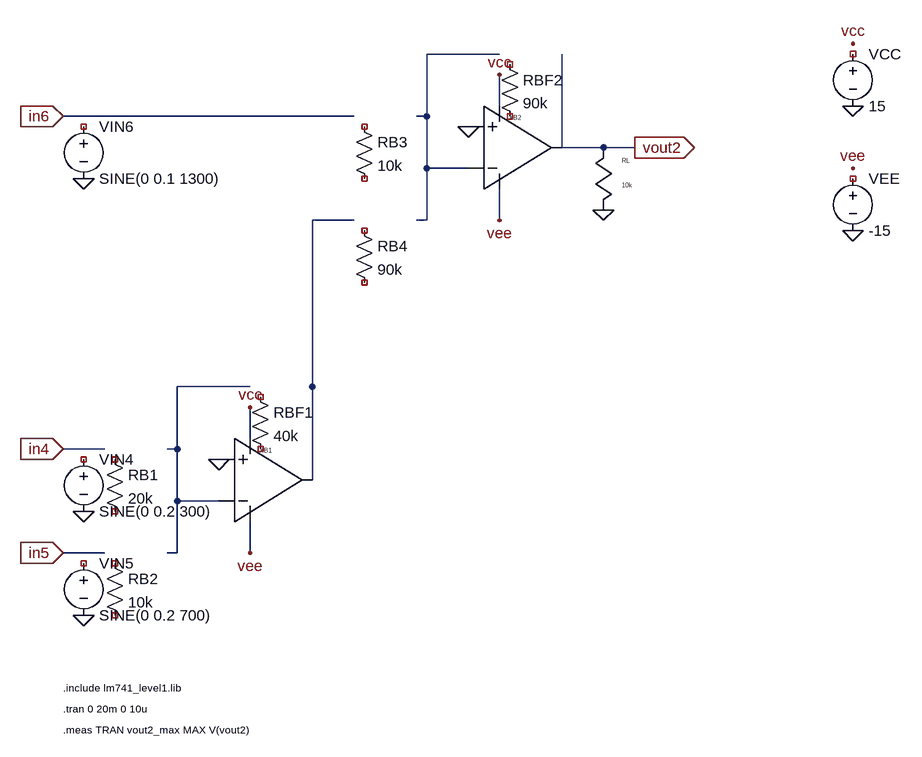
[diagram p0: schematic rs2_bloco_b.asc]
rs2_bloco_b.asc, the LTspice schematic file:
Version 4
SHEET 1 1541 1335
WIRE 608 208 624 208
WIRE 608 368 624 368
WIRE 624 112 624 368
WIRE 624 288 688 288
WIRE 736 192 736 144
WIRE 736 320 736 368
WIRE 624 112 736 112
WIRE 832 112 832 256
WIRE 224 720 240 720
WIRE 224 880 240 880
WIRE 240 624 240 880
WIRE 240 800 304 800
WIRE 352 704 352 656
WIRE 352 832 352 880
WIRE 240 624 352 624
WIRE 448 624 448 768
WIRE 448 768 448 368
WIRE 448 368 512 368
WIRE 64 208 512 208
WIRE 64 720 128 720
WIRE 64 880 128 880
WIRE 832 256 944 256
SYMBOL res 512 208 R0
SYMATTR InstName RB3
SYMATTR Value 10k
SYMBOL res 512 368 R0
SYMATTR InstName RB4
SYMATTR Value 90k
SYMBOL opamp2 688 192 R0
SYMATTR InstName XB2
SYMATTR Value LM741_LEVEL1
SYMBOL res 736 112 R0
SYMATTR InstName RBF2
SYMATTR Value 90k
SYMBOL res 128 720 R0
SYMATTR InstName RB1
SYMATTR Value 20k
SYMBOL res 128 880 R0
SYMATTR InstName RB2
SYMATTR Value 10k
SYMBOL opamp2 304 704 R0
SYMATTR InstName XB1
SYMATTR Value LM741_LEVEL1
SYMBOL res 352 624 R0
SYMATTR InstName RBF1
SYMATTR Value 40k
SYMBOL voltage 96 208 R0
SYMATTR InstName VIN6
SYMATTR Value SINE(0 0.1 1300)
SYMBOL voltage 96 720 R0
SYMATTR InstName VIN4
SYMATTR Value SINE(0 0.2 300)
SYMBOL voltage 96 880 R0
SYMATTR InstName VIN5
SYMATTR Value SINE(0 0.2 700)
SYMBOL res_v 896 256 R0
SYMATTR InstName RL
SYMATTR Value 10k
SYMBOL voltage 1280 96 R0
SYMATTR InstName VCC
SYMATTR Value 15
SYMBOL voltage 1280 288 R0
SYMATTR InstName VEE
SYMATTR Value -15
FLAG 688 224 0
FLAG 736 144 vcc
FLAG 736 368 vee
FLAG 304 736 0
FLAG 352 656 vcc
FLAG 352 880 vee
FLAG 96 304 0
FLAG 64 208 in6
IOPIN 64 208 In
FLAG 96 816 0
FLAG 64 720 in4
IOPIN 64 720 In
FLAG 96 976 0
FLAG 64 880 in5
IOPIN 64 880 In
FLAG 896 352 0
FLAG 944 256 vout2
IOPIN 944 256 Out
FLAG 1280 96 vcc
FLAG 1280 192 0
FLAG 1280 288 vee
FLAG 1280 384 0
TEXT 64 1088 Left 1 !.include lm741_level1.lib
TEXT 64 1120 Left 1 !.tran 0 20m 0 10u
TEXT 64 1152 Left 1 !.meas TRAN vout2_max MAX V(vout2)

The netlist it stands for:
* rs2_bloco_b.asc
RB3 NC_01 NC_02 10k
RB4 NC_03 NC_04 90k
XXB2 CLAW_IDEAL_OPAMP LM741_LEVEL1
RBF2 NC_05 NC_06 90k
RB1 NC_07 NC_08 20k
RB2 NC_09 NC_10 10k
XXB1 CLAW_IDEAL_OPAMP LM741_LEVEL1
RBF1 NC_11 NC_12 40k
VIN6 NC_13 0 SINE(0 0.1 1300)
VIN4 NC_14 0 SINE(0 0.2 300)
VIN5 NC_15 0 SINE(0 0.2 700)
RL vout2 0 10k
VCC NC_16 0 15
VEE NC_17 0 -15
.include lm741_level1.lib
.tran 0 20m 0 10u
.meas TRAN vout2_max MAX V(vout2)
.backanno
.end